# EAGLE design analog-io-breakout (EAGLE 8.3.2)
DESIGNER: JAKOB VOIGTS & JON NEWMAN; DESIGN_NAME: IO BOARD; LICENSE: CERN OHL v1.2; REVISION: 1.1
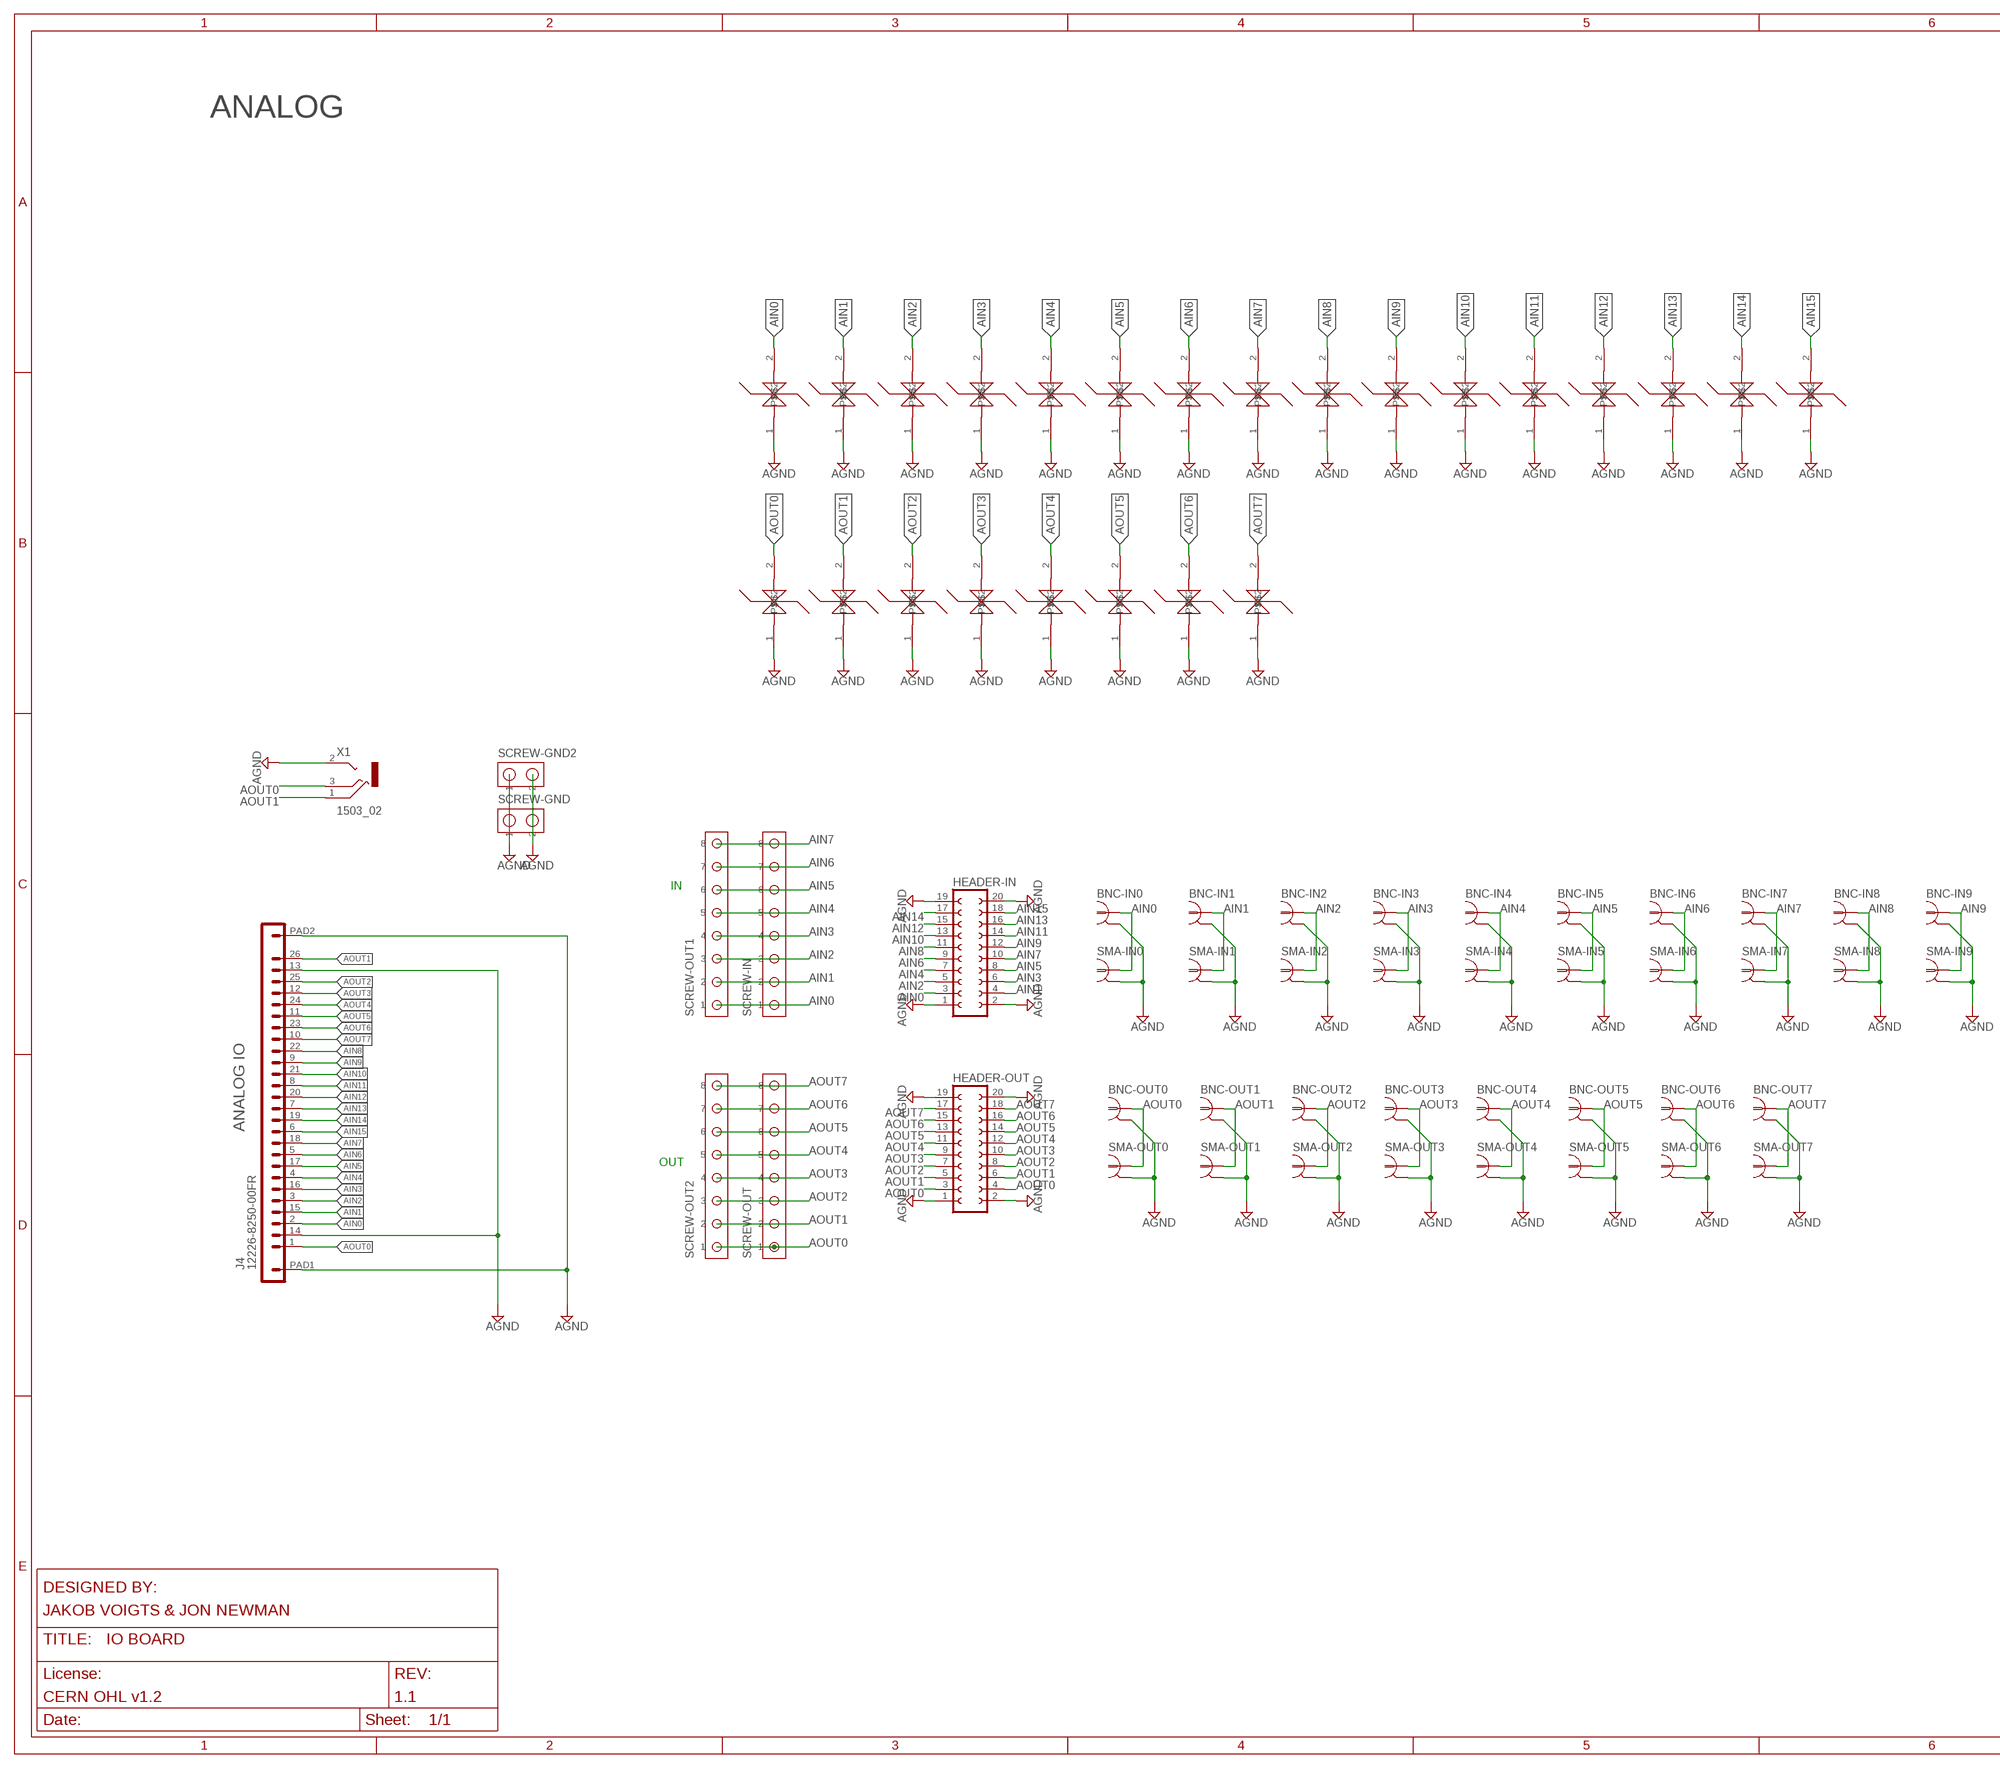
[diagram p0: schematic, sheet 1, part 1 of 2]
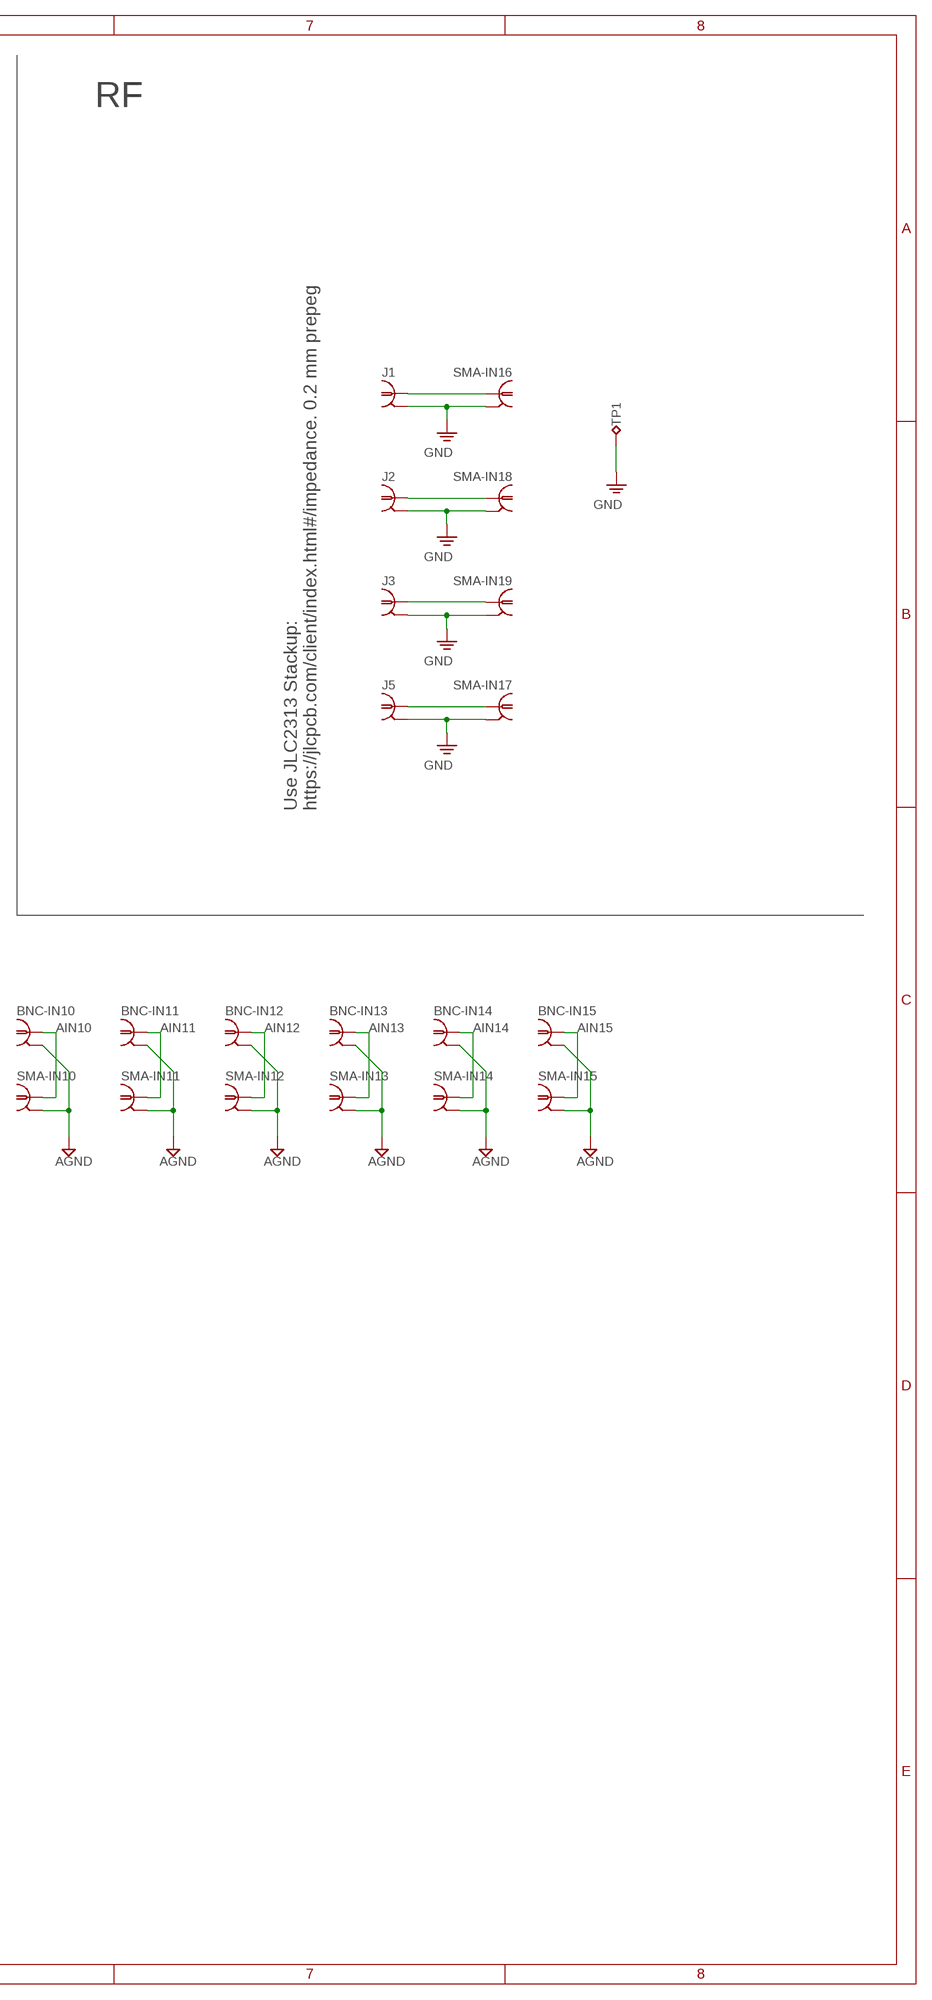
[diagram p1: schematic, sheet 1, part 2 of 2]

## Parts
BNC-IN0  COAX_B35N61-LARGE-HOLES  [B35N61_LARGE-HOLES]
BNC-IN1  COAX_B35N61-LARGE-HOLES  [B35N61_LARGE-HOLES]
BNC-IN2  COAX_B35N61-LARGE-HOLES  [B35N61_LARGE-HOLES]
BNC-IN3  COAX_B35N61-LARGE-HOLES  [B35N61_LARGE-HOLES]
BNC-IN4  COAX_B35N61-LARGE-HOLES  [B35N61_LARGE-HOLES]
BNC-IN5  COAX_B35N61-LARGE-HOLES  [B35N61_LARGE-HOLES]
BNC-IN6  COAX_B35N61-LARGE-HOLES  [B35N61_LARGE-HOLES]
BNC-IN7  COAX_B35N61-LARGE-HOLES  [B35N61_LARGE-HOLES]
BNC-IN8  COAX_B35N61-LARGE-HOLES  [B35N61_LARGE-HOLES]
BNC-IN9  COAX_B35N61-LARGE-HOLES  [B35N61_LARGE-HOLES]
BNC-IN10  COAX_B35N61-LARGE-HOLES  [B35N61_LARGE-HOLES]
BNC-IN11  COAX_B35N61-LARGE-HOLES  [B35N61_LARGE-HOLES]
BNC-IN12  COAX_B35N61-LARGE-HOLES  [B35N61_LARGE-HOLES]
BNC-IN13  COAX_B35N61-LARGE-HOLES  [B35N61_LARGE-HOLES]
BNC-IN14  COAX_B35N61-LARGE-HOLES  [B35N61_LARGE-HOLES]
BNC-IN15  COAX_B35N61-LARGE-HOLES  [B35N61_LARGE-HOLES]
BNC-OUT0  COAX_B35N61-LARGE-HOLES  [B35N61_LARGE-HOLES]
BNC-OUT1  COAX_B35N61-LARGE-HOLES  [B35N61_LARGE-HOLES]
BNC-OUT2  COAX_B35N61-LARGE-HOLES  [B35N61_LARGE-HOLES]
BNC-OUT3  COAX_B35N61-LARGE-HOLES  [B35N61_LARGE-HOLES]
BNC-OUT4  COAX_B35N61-LARGE-HOLES  [B35N61_LARGE-HOLES]
BNC-OUT5  COAX_B35N61-LARGE-HOLES  [B35N61_LARGE-HOLES]
BNC-OUT6  COAX_B35N61-LARGE-HOLES  [B35N61_LARGE-HOLES]
BNC-OUT7  COAX_B35N61-LARGE-HOLES  [B35N61_LARGE-HOLES]
HEADER-IN  FE10-2  [FE10-2]
HEADER-OUT  FE10-2  [FE10-2]
J1  COAX_MMCX-RA  [MMCX-J-P-X-RA-SM1]
J2  COAX_MMCX-RA  [MMCX-J-P-X-RA-SM1]
J3  COAX_MMCX-RA  [MMCX-J-P-X-RA-SM1]
J4  12226-8250-00FR  PINHD-1X26_122  [12226-82X0-00XX]
J5  COAX_MMCX-RA  [MMCX-J-P-X-RA-SM1]
SCREW-GND  SCREW2  [SCREW2]
SCREW-GND2  SCREW2  [SCREW2]
SCREW-IN  SCREW8  [SCREW8]
SCREW-OUT  SCREW8  [SCREW8]
SCREW-OUT1  SCREW8  [SCREW8]
SCREW-OUT2  SCREW8  [SCREW8]
SMA-IN0  COAX_SMA-VERT  [SMA_JACK_142-0701-201]
SMA-IN1  COAX_SMA-VERT  [SMA_JACK_142-0701-201]
SMA-IN2  COAX_SMA-VERT  [SMA_JACK_142-0701-201]
SMA-IN3  COAX_SMA-VERT  [SMA_JACK_142-0701-201]
SMA-IN4  COAX_SMA-VERT  [SMA_JACK_142-0701-201]
SMA-IN5  COAX_SMA-VERT  [SMA_JACK_142-0701-201]
SMA-IN6  COAX_SMA-VERT  [SMA_JACK_142-0701-201]
SMA-IN7  COAX_SMA-VERT  [SMA_JACK_142-0701-201]
SMA-IN8  COAX_SMA-VERT  [SMA_JACK_142-0701-201]
SMA-IN9  COAX_SMA-VERT  [SMA_JACK_142-0701-201]
SMA-IN10  COAX_SMA-VERT  [SMA_JACK_142-0701-201]
SMA-IN11  COAX_SMA-VERT  [SMA_JACK_142-0701-201]
SMA-IN12  COAX_SMA-VERT  [SMA_JACK_142-0701-201]
SMA-IN13  COAX_SMA-VERT  [SMA_JACK_142-0701-201]
SMA-IN14  COAX_SMA-VERT  [SMA_JACK_142-0701-201]
SMA-IN15  COAX_SMA-VERT  [SMA_JACK_142-0701-201]
SMA-IN16  COAX_SMA-VERT  [SMA_JACK_142-0701-201]
SMA-IN17  COAX_SMA-VERT  [SMA_JACK_142-0701-201]
SMA-IN18  COAX_SMA-VERT  [SMA_JACK_142-0701-201]
SMA-IN19  COAX_SMA-VERT  [SMA_JACK_142-0701-201]
SMA-OUT0  COAX_SMA-VERT  [SMA_JACK_142-0701-201]
SMA-OUT1  COAX_SMA-VERT  [SMA_JACK_142-0701-201]
SMA-OUT2  COAX_SMA-VERT  [SMA_JACK_142-0701-201]
SMA-OUT3  COAX_SMA-VERT  [SMA_JACK_142-0701-201]
SMA-OUT4  COAX_SMA-VERT  [SMA_JACK_142-0701-201]
SMA-OUT5  COAX_SMA-VERT  [SMA_JACK_142-0701-201]
SMA-OUT6  COAX_SMA-VERT  [SMA_JACK_142-0701-201]
SMA-OUT7  COAX_SMA-VERT  [SMA_JACK_142-0701-201]
TP1  TP_2MM  [TESTPOINT_2MM]
U$1  DIODE-ESD-BIDIRECTIONALDO-214AA  [DIOC7026X260]
U$2  DIODE-ESD-BIDIRECTIONALDO-214AA  [DIOC7026X260]
U$3  DIODE-ESD-BIDIRECTIONALDO-214AA  [DIOC7026X260]
U$4  DIODE-ESD-BIDIRECTIONALDO-214AA  [DIOC7026X260]
U$5  DIODE-ESD-BIDIRECTIONALDO-214AA  [DIOC7026X260]
U$6  DIODE-ESD-BIDIRECTIONALDO-214AA  [DIOC7026X260]
U$7  DIODE-ESD-BIDIRECTIONALDO-214AA  [DIOC7026X260]
U$8  DIODE-ESD-BIDIRECTIONALDO-214AA  [DIOC7026X260]
U$9  DIODE-ESD-BIDIRECTIONALDO-214AA  [DIOC7026X260]
U$10  DIODE-ESD-BIDIRECTIONALDO-214AA  [DIOC7026X260]
U$11  DIODE-ESD-BIDIRECTIONALDO-214AA  [DIOC7026X260]
U$12  DIODE-ESD-BIDIRECTIONALDO-214AA  [DIOC7026X260]
U$13  DIODE-ESD-BIDIRECTIONALDO-214AA  [DIOC7026X260]
U$14  DIODE-ESD-BIDIRECTIONALDO-214AA  [DIOC7026X260]
U$15  DIODE-ESD-BIDIRECTIONALDO-214AA  [DIOC7026X260]
U$16  DIODE-ESD-BIDIRECTIONALDO-214AA  [DIOC7026X260]
U$17  DIODE-ESD-BIDIRECTIONALDO-214AA  [DIOC7026X260]
U$18  DIODE-ESD-BIDIRECTIONALDO-214AA  [DIOC7026X260]
U$19  DIODE-ESD-BIDIRECTIONALDO-214AA  [DIOC7026X260]
U$20  DIODE-ESD-BIDIRECTIONALDO-214AA  [DIOC7026X260]
U$21  DIODE-ESD-BIDIRECTIONALDO-214AA  [DIOC7026X260]
U$22  DIODE-ESD-BIDIRECTIONALDO-214AA  [DIOC7026X260]
U$23  DIODE-ESD-BIDIRECTIONALDO-214AA  [DIOC7026X260]
U$24  DIODE-ESD-BIDIRECTIONALDO-214AA  [DIOC7026X260]
X1  1503_02  [1503_02]

## Nets
AGND: BNC-IN0.2 BNC-IN0.3 BNC-IN0.4 BNC-IN0.5 BNC-IN1.2 BNC-IN1.3 BNC-IN1.4 BNC-IN1.5 BNC-IN2.2 BNC-IN2.3 BNC-IN2.4 BNC-IN2.5 BNC-IN3.2 BNC-IN3.3 BNC-IN3.4 BNC-IN3.5 BNC-IN4.2 BNC-IN4.3 BNC-IN4.4 BNC-IN4.5 BNC-IN5.2 BNC-IN5.3 BNC-IN5.4 BNC-IN5.5 BNC-IN6.2 BNC-IN6.3 BNC-IN6.4 BNC-IN6.5 BNC-IN7.2 BNC-IN7.3 BNC-IN7.4 BNC-IN7.5 BNC-IN8.2 BNC-IN8.3 BNC-IN8.4 BNC-IN8.5 BNC-IN9.2 BNC-IN9.3 BNC-IN9.4 BNC-IN9.5 BNC-IN10.2 BNC-IN10.3 BNC-IN10.4 BNC-IN10.5 BNC-IN11.2 BNC-IN11.3 BNC-IN11.4 BNC-IN11.5 BNC-IN12.2 BNC-IN12.3 BNC-IN12.4 BNC-IN12.5 BNC-IN13.2 BNC-IN13.3 BNC-IN13.4 BNC-IN13.5 BNC-IN14.2 BNC-IN14.3 BNC-IN14.4 BNC-IN14.5 BNC-IN15.2 BNC-IN15.3 BNC-IN15.4 BNC-IN15.5 BNC-OUT0.2 BNC-OUT0.3 BNC-OUT0.4 BNC-OUT0.5 BNC-OUT1.2 BNC-OUT1.3 BNC-OUT1.4 BNC-OUT1.5 BNC-OUT2.2 BNC-OUT2.3 BNC-OUT2.4 BNC-OUT2.5 BNC-OUT3.2 BNC-OUT3.3 BNC-OUT3.4 BNC-OUT3.5 BNC-OUT4.2 BNC-OUT4.3 BNC-OUT4.4 BNC-OUT4.5 BNC-OUT5.2 BNC-OUT5.3 BNC-OUT5.4 BNC-OUT5.5 BNC-OUT6.2 BNC-OUT6.3 BNC-OUT6.4 BNC-OUT6.5 BNC-OUT7.2 BNC-OUT7.3 BNC-OUT7.4 BNC-OUT7.5 HEADER-IN.1 HEADER-IN.2 HEADER-IN.19 HEADER-IN.20 HEADER-OUT.1 HEADER-OUT.2 HEADER-OUT.19 HEADER-OUT.20 J4.13 J4.14 J4.PAD1 J4.PAD2 SCREW-GND2.P$1 SCREW-GND2.P$2 SCREW-GND.P$1 SCREW-GND.P$2 SMA-IN0.GND$1 SMA-IN0.GND$2 SMA-IN0.GND$3 SMA-IN0.GND$4 SMA-IN1.GND$1 SMA-IN1.GND$2 SMA-IN1.GND$3 SMA-IN1.GND$4 SMA-IN2.GND$1 SMA-IN2.GND$2 SMA-IN2.GND$3 SMA-IN2.GND$4 SMA-IN3.GND$1 SMA-IN3.GND$2 SMA-IN3.GND$3 SMA-IN3.GND$4 SMA-IN4.GND$1 SMA-IN4.GND$2 SMA-IN4.GND$3 SMA-IN4.GND$4 SMA-IN5.GND$1 SMA-IN5.GND$2 SMA-IN5.GND$3 SMA-IN5.GND$4 SMA-IN6.GND$1 SMA-IN6.GND$2 SMA-IN6.GND$3 SMA-IN6.GND$4 SMA-IN7.GND$1 SMA-IN7.GND$2 SMA-IN7.GND$3 SMA-IN7.GND$4 SMA-IN8.GND$1 SMA-IN8.GND$2 SMA-IN8.GND$3 SMA-IN8.GND$4 SMA-IN9.GND$1 SMA-IN9.GND$2 SMA-IN9.GND$3 SMA-IN9.GND$4 SMA-IN10.GND$1 SMA-IN10.GND$2 SMA-IN10.GND$3 SMA-IN10.GND$4 SMA-IN11.GND$1 SMA-IN11.GND$2 SMA-IN11.GND$3 SMA-IN11.GND$4 SMA-IN12.GND$1 SMA-IN12.GND$2 SMA-IN12.GND$3 SMA-IN12.GND$4 SMA-IN13.GND$1 SMA-IN13.GND$2 SMA-IN13.GND$3 SMA-IN13.GND$4 SMA-IN14.GND$1 SMA-IN14.GND$2 SMA-IN14.GND$3 SMA-IN14.GND$4 SMA-IN15.GND$1 SMA-IN15.GND$2 SMA-IN15.GND$3 SMA-IN15.GND$4 SMA-OUT0.GND$1 SMA-OUT0.GND$2 SMA-OUT0.GND$3 SMA-OUT0.GND$4 SMA-OUT1.GND$1 SMA-OUT1.GND$2 SMA-OUT1.GND$3 SMA-OUT1.GND$4 SMA-OUT2.GND$1 SMA-OUT2.GND$2 SMA-OUT2.GND$3 SMA-OUT2.GND$4 SMA-OUT3.GND$1 SMA-OUT3.GND$2 SMA-OUT3.GND$3 SMA-OUT3.GND$4 SMA-OUT4.GND$1 SMA-OUT4.GND$2 SMA-OUT4.GND$3 SMA-OUT4.GND$4 SMA-OUT5.GND$1 SMA-OUT5.GND$2 SMA-OUT5.GND$3 SMA-OUT5.GND$4 SMA-OUT6.GND$1 SMA-OUT6.GND$2 SMA-OUT6.GND$3 SMA-OUT6.GND$4 SMA-OUT7.GND$1 SMA-OUT7.GND$2 SMA-OUT7.GND$3 SMA-OUT7.GND$4 U$1.1 U$2.1 U$3.1 U$4.1 U$5.1 U$6.1 U$7.1 U$8.1 U$9.1 U$10.1 U$11.1 U$12.1 U$13.1 U$14.1 U$15.1 U$16.1 U$17.1 U$18.1 U$19.1 U$20.1 U$21.1 U$22.1 U$23.1 U$24.1 X1.2
AIN0: BNC-IN0.1 HEADER-IN.3 J4.2 SCREW-IN.1 SCREW-OUT1.1 SMA-IN0.CLK U$1.2
AIN1: BNC-IN1.1 HEADER-IN.4 J4.15 SCREW-IN.2 SCREW-OUT1.2 SMA-IN1.CLK U$2.2
AIN2: BNC-IN2.1 HEADER-IN.5 J4.3 SCREW-IN.3 SCREW-OUT1.3 SMA-IN2.CLK U$3.2
AIN3: BNC-IN3.1 HEADER-IN.6 J4.16 SCREW-IN.4 SCREW-OUT1.4 SMA-IN3.CLK U$4.2
AIN4: BNC-IN4.1 HEADER-IN.7 J4.4 SCREW-IN.5 SCREW-OUT1.5 SMA-IN4.CLK U$5.2
AIN5: BNC-IN5.1 HEADER-IN.8 J4.17 SCREW-IN.6 SCREW-OUT1.6 SMA-IN5.CLK U$6.2
AIN6: BNC-IN6.1 HEADER-IN.9 J4.5 SCREW-IN.7 SCREW-OUT1.7 SMA-IN6.CLK U$7.2
AIN7: BNC-IN7.1 HEADER-IN.10 J4.18 SCREW-IN.8 SCREW-OUT1.8 SMA-IN7.CLK U$8.2
AIN8: BNC-IN8.1 HEADER-IN.11 J4.22 SMA-IN8.CLK U$17.2
AIN9: BNC-IN9.1 HEADER-IN.12 J4.9 SMA-IN9.CLK U$18.2
AIN10: BNC-IN10.1 HEADER-IN.13 J4.21 SMA-IN10.CLK U$19.2
AIN11: BNC-IN11.1 HEADER-IN.14 J4.8 SMA-IN11.CLK U$20.2
AIN12: BNC-IN12.1 HEADER-IN.15 J4.20 SMA-IN12.CLK U$21.2
AIN13: BNC-IN13.1 HEADER-IN.16 J4.7 SMA-IN13.CLK U$22.2
AIN14: BNC-IN14.1 HEADER-IN.17 J4.19 SMA-IN14.CLK U$23.2
AIN15: BNC-IN15.1 HEADER-IN.18 J4.6 SMA-IN15.CLK U$24.2
AOUT0: BNC-OUT0.1 HEADER-OUT.3 HEADER-OUT.4 J4.1 SCREW-OUT2.1 SCREW-OUT.1 SMA-OUT0.CLK U$9.2 X1.3
AOUT1: BNC-OUT1.1 HEADER-OUT.5 HEADER-OUT.6 J4.26 SCREW-OUT2.2 SCREW-OUT.2 SMA-OUT1.CLK U$10.2 X1.1
AOUT2: BNC-OUT2.1 HEADER-OUT.7 HEADER-OUT.8 J4.25 SCREW-OUT2.3 SCREW-OUT.3 SMA-OUT2.CLK U$11.2
AOUT3: BNC-OUT3.1 HEADER-OUT.9 HEADER-OUT.10 J4.12 SCREW-OUT2.4 SCREW-OUT.4 SMA-OUT3.CLK U$12.2
AOUT4: BNC-OUT4.1 HEADER-OUT.11 HEADER-OUT.12 J4.24 SCREW-OUT2.5 SCREW-OUT.5 SMA-OUT4.CLK U$13.2
AOUT5: BNC-OUT5.1 HEADER-OUT.13 HEADER-OUT.14 J4.11 SCREW-OUT2.6 SCREW-OUT.6 SMA-OUT5.CLK U$14.2
AOUT6: BNC-OUT6.1 HEADER-OUT.15 HEADER-OUT.16 J4.23 SCREW-OUT2.7 SCREW-OUT.7 SMA-OUT6.CLK U$15.2
AOUT7: BNC-OUT7.1 HEADER-OUT.17 HEADER-OUT.18 J4.10 SCREW-OUT2.8 SCREW-OUT.8 SMA-OUT7.CLK U$16.2
GND: J1.2 J1.3 J1.4 J1.5 J2.2 J2.3 J2.4 J2.5 J3.2 J3.3 J3.4 J3.5 J5.2 J5.3 J5.4 J5.5 SMA-IN16.GND$1 SMA-IN16.GND$2 SMA-IN16.GND$3 SMA-IN16.GND$4 SMA-IN17.GND$1 SMA-IN17.GND$2 SMA-IN17.GND$3 SMA-IN17.GND$4 SMA-IN18.GND$1 SMA-IN18.GND$2 SMA-IN18.GND$3 SMA-IN18.GND$4 SMA-IN19.GND$1 SMA-IN19.GND$2 SMA-IN19.GND$3 SMA-IN19.GND$4 TP1.1(TP)
N$1: J1.1 SMA-IN16.CLK
N$3: J2.1 SMA-IN18.CLK
N$4: J3.1 SMA-IN19.CLK
N$5: J5.1 SMA-IN17.CLK
Unconnected: X1.2@2

## Notes on the sheet
- RF
- ANALOG
- Use JLC2313 Stackup: 
  https://jlcpcb.com/client/index.html#/impedance. 0.2 mm prepeg
- IN
- ANALOG IO
- OUT

## Library data of the parts
BNC-IN0 BNC-IN1-BNC-IN15 BNC-OUT0 BNC-OUT1-BNC-OUT7 J1-J3 J5 SMA-IN0 SMA-IN1-SMA-IN19 SMA-OUT0 SMA-OUT1-SMA-OUT7 = jonnew:COAX: COAX CONNECTOR - Edge mount BNC - Vertical BNC - Vertical SMA - etc
HEADER-IN HEADER-OUT = con-lsta:FE10-2: FEMALE HEADER; OC_FARNELL: unknown; OC_NEWARK: unknown
J4 = jonnew:PINHD-1X26
SCREW-GND SCREW-GND2 = jonnew:SCREW2: Screw Terminal
SCREW-IN SCREW-OUT SCREW-OUT1 SCREW-OUT2 = jonnew:SCREW8: Screw Terminal
TP1 = jonnew:TP: Test pad
U$1-U$24 = jonnew:DIODE-ESD-BIDIRECTIONAL
X1 = con-lumberg:1503_02: Jack connectors according to JISC 6560, 3.5 mm Klinkeneinbaukupplung nach JISC 6560, 3,5 mm, 3-polig/stereo, abgewinkelte Ausführung, Surface-Mount-Technik (SMT) Source: http://www.lumberg.com/Produkte/PDFs/1503_02.pdf; OC_FARNELL: 1216979; OC_NEWARK: unknown

## Net classes
1 diff: width 0.229 mm, drill 0.33 mm, clearance 0.127 mm

## Board
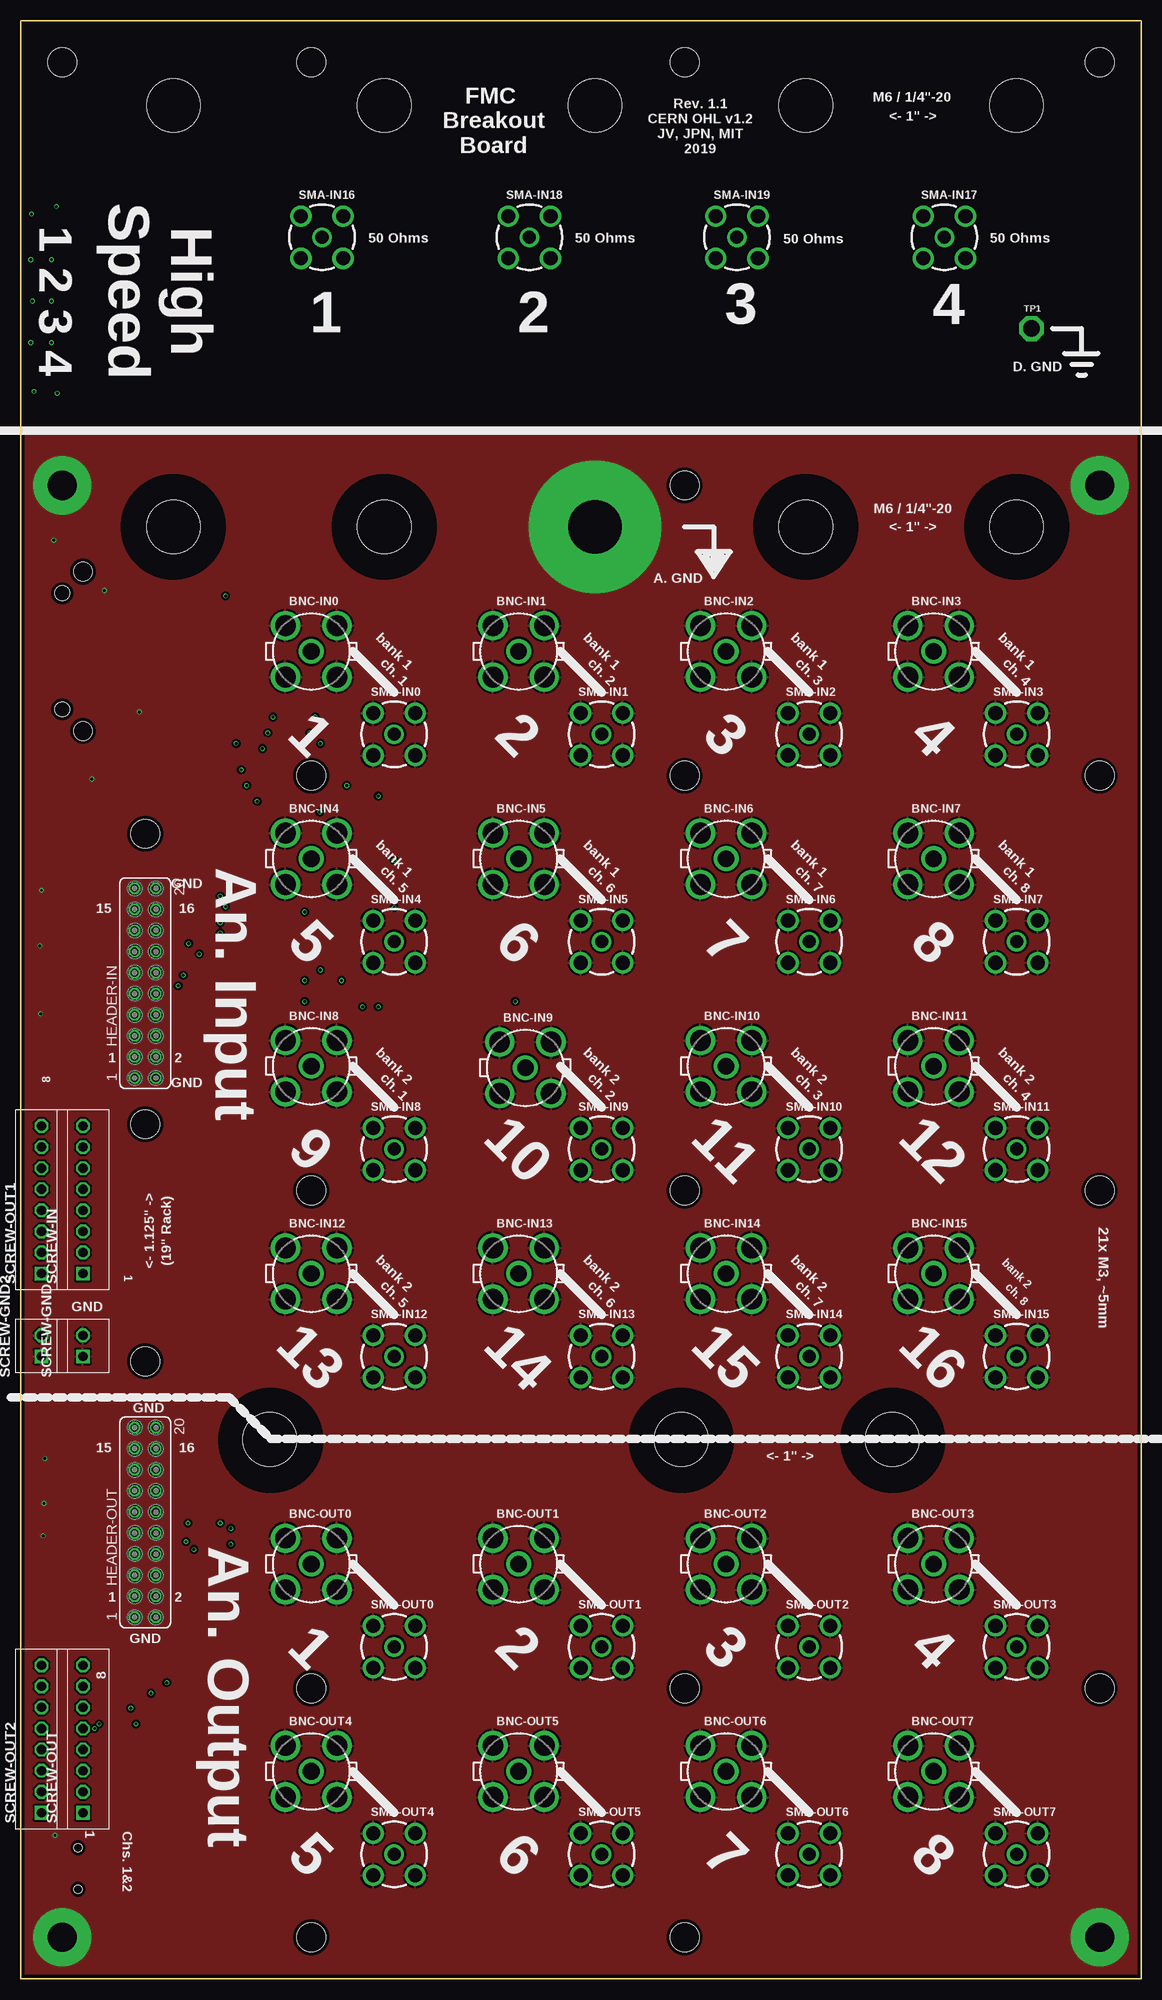
[diagram p2: board, top side]
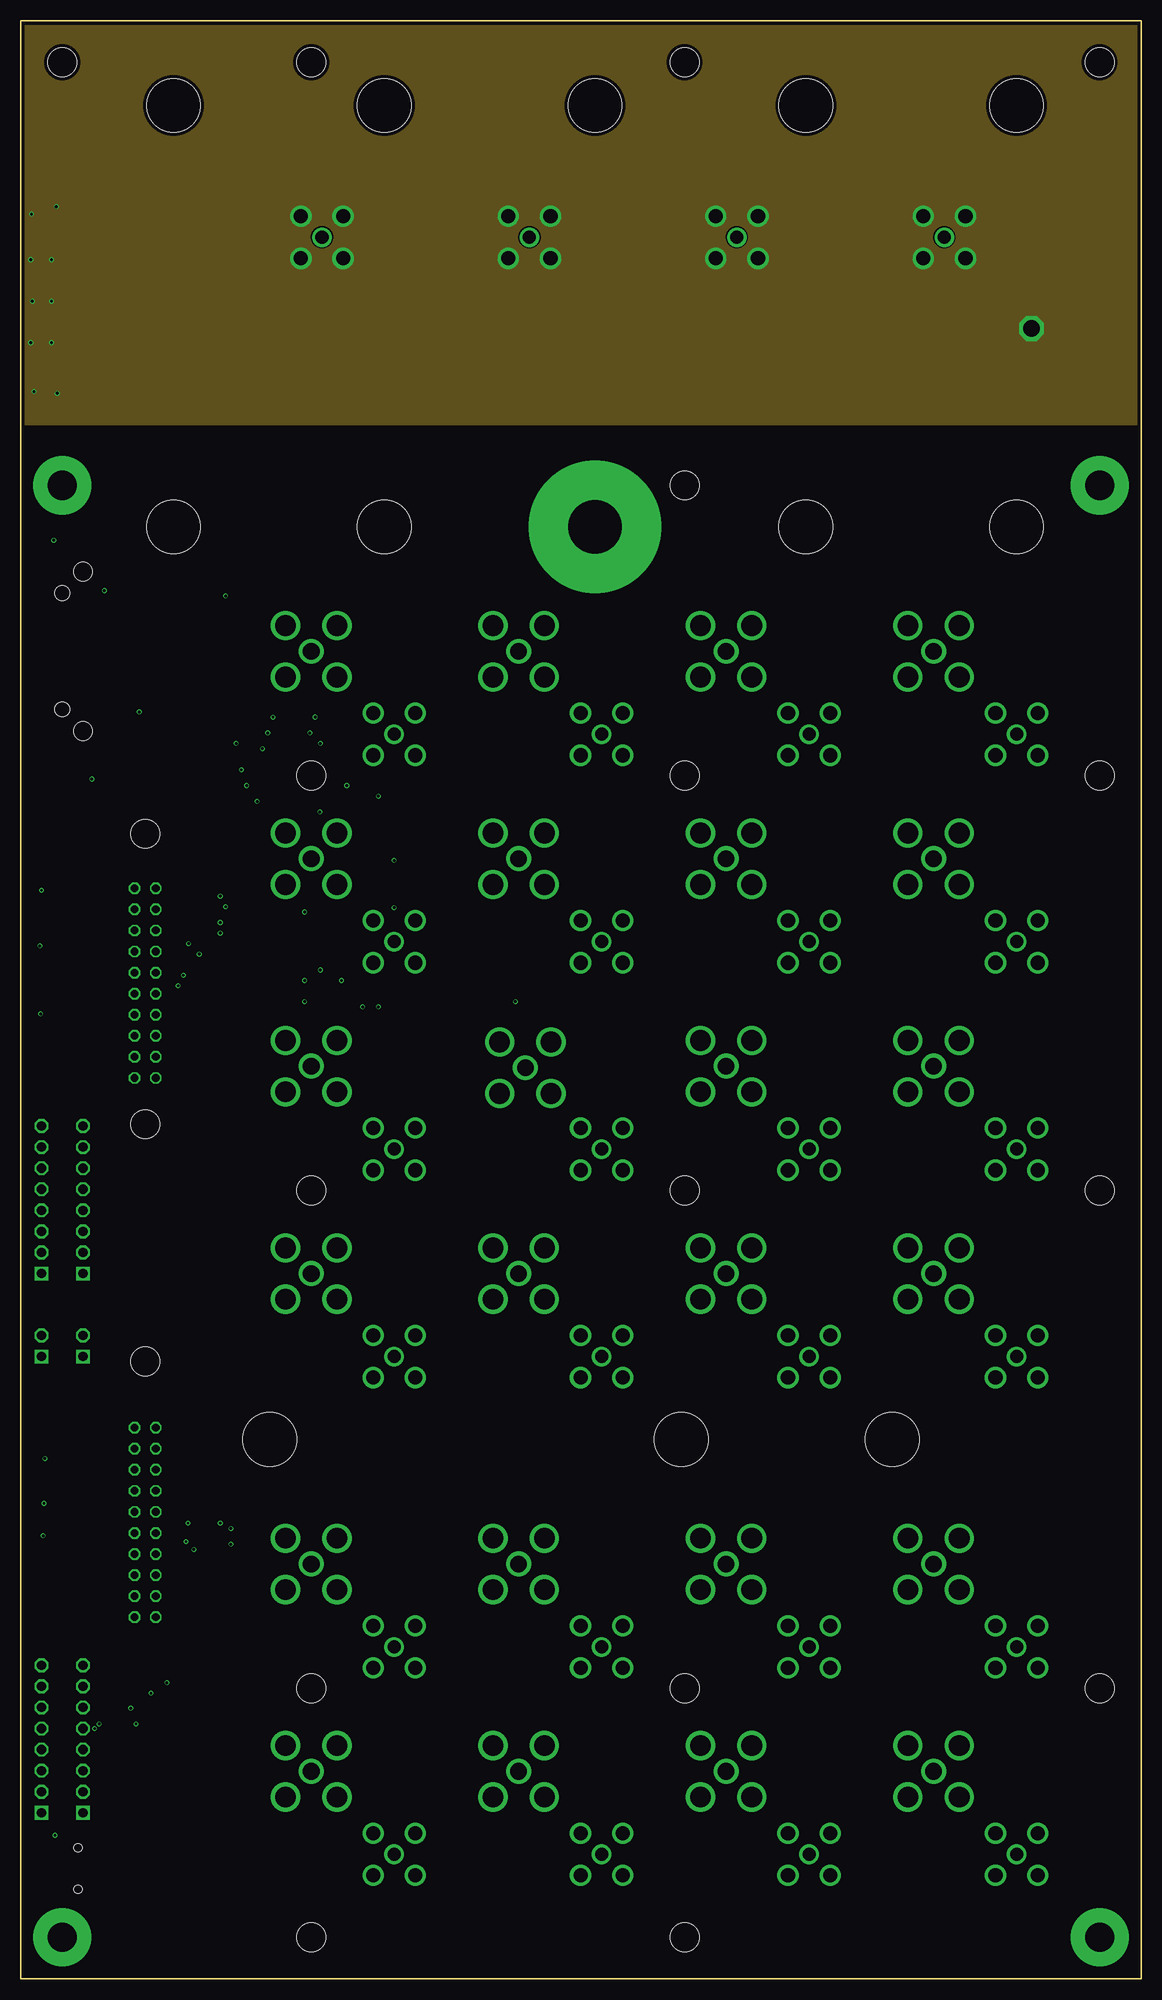
[diagram p3: board, inner layer Route2]
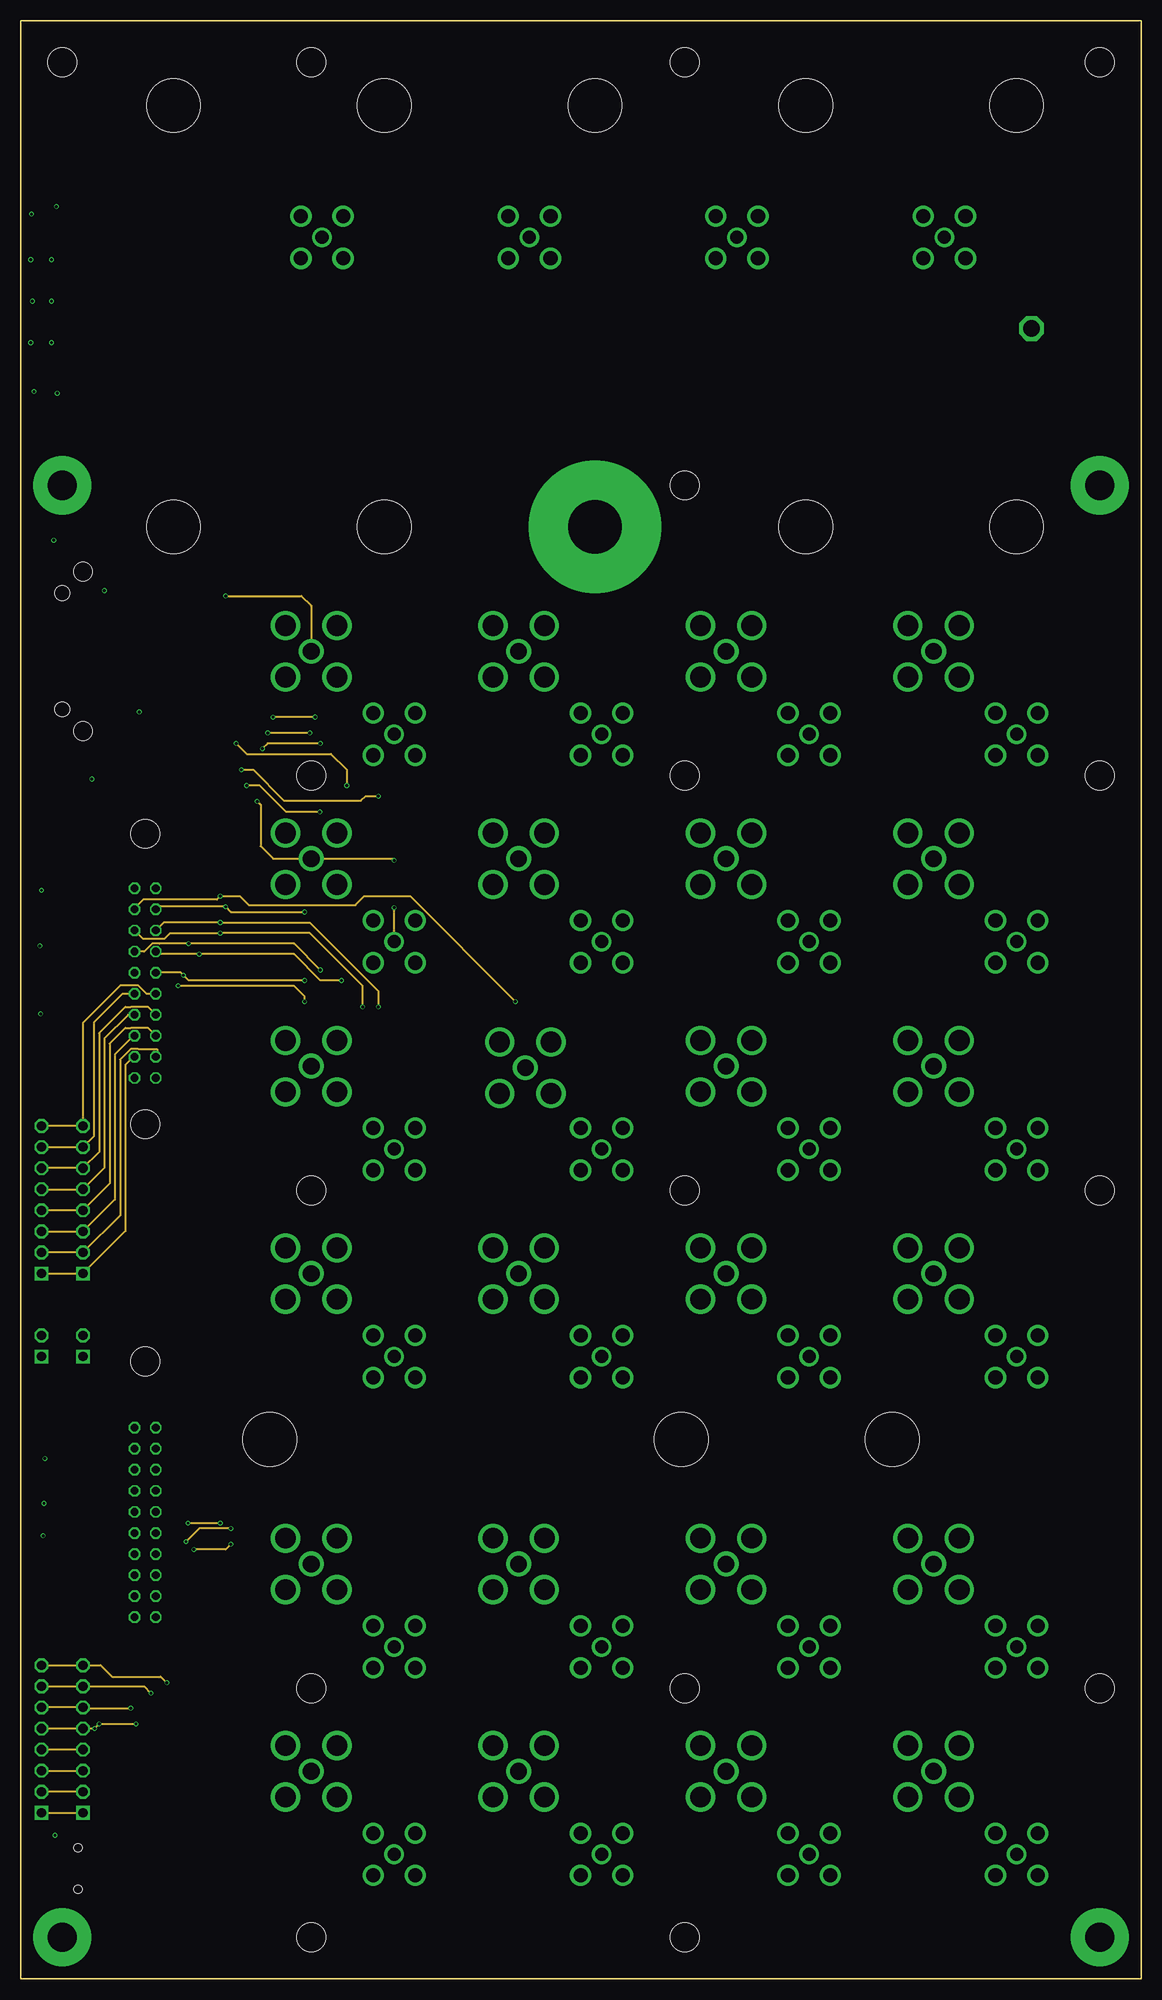
[diagram p4: board, inner layer Route15]
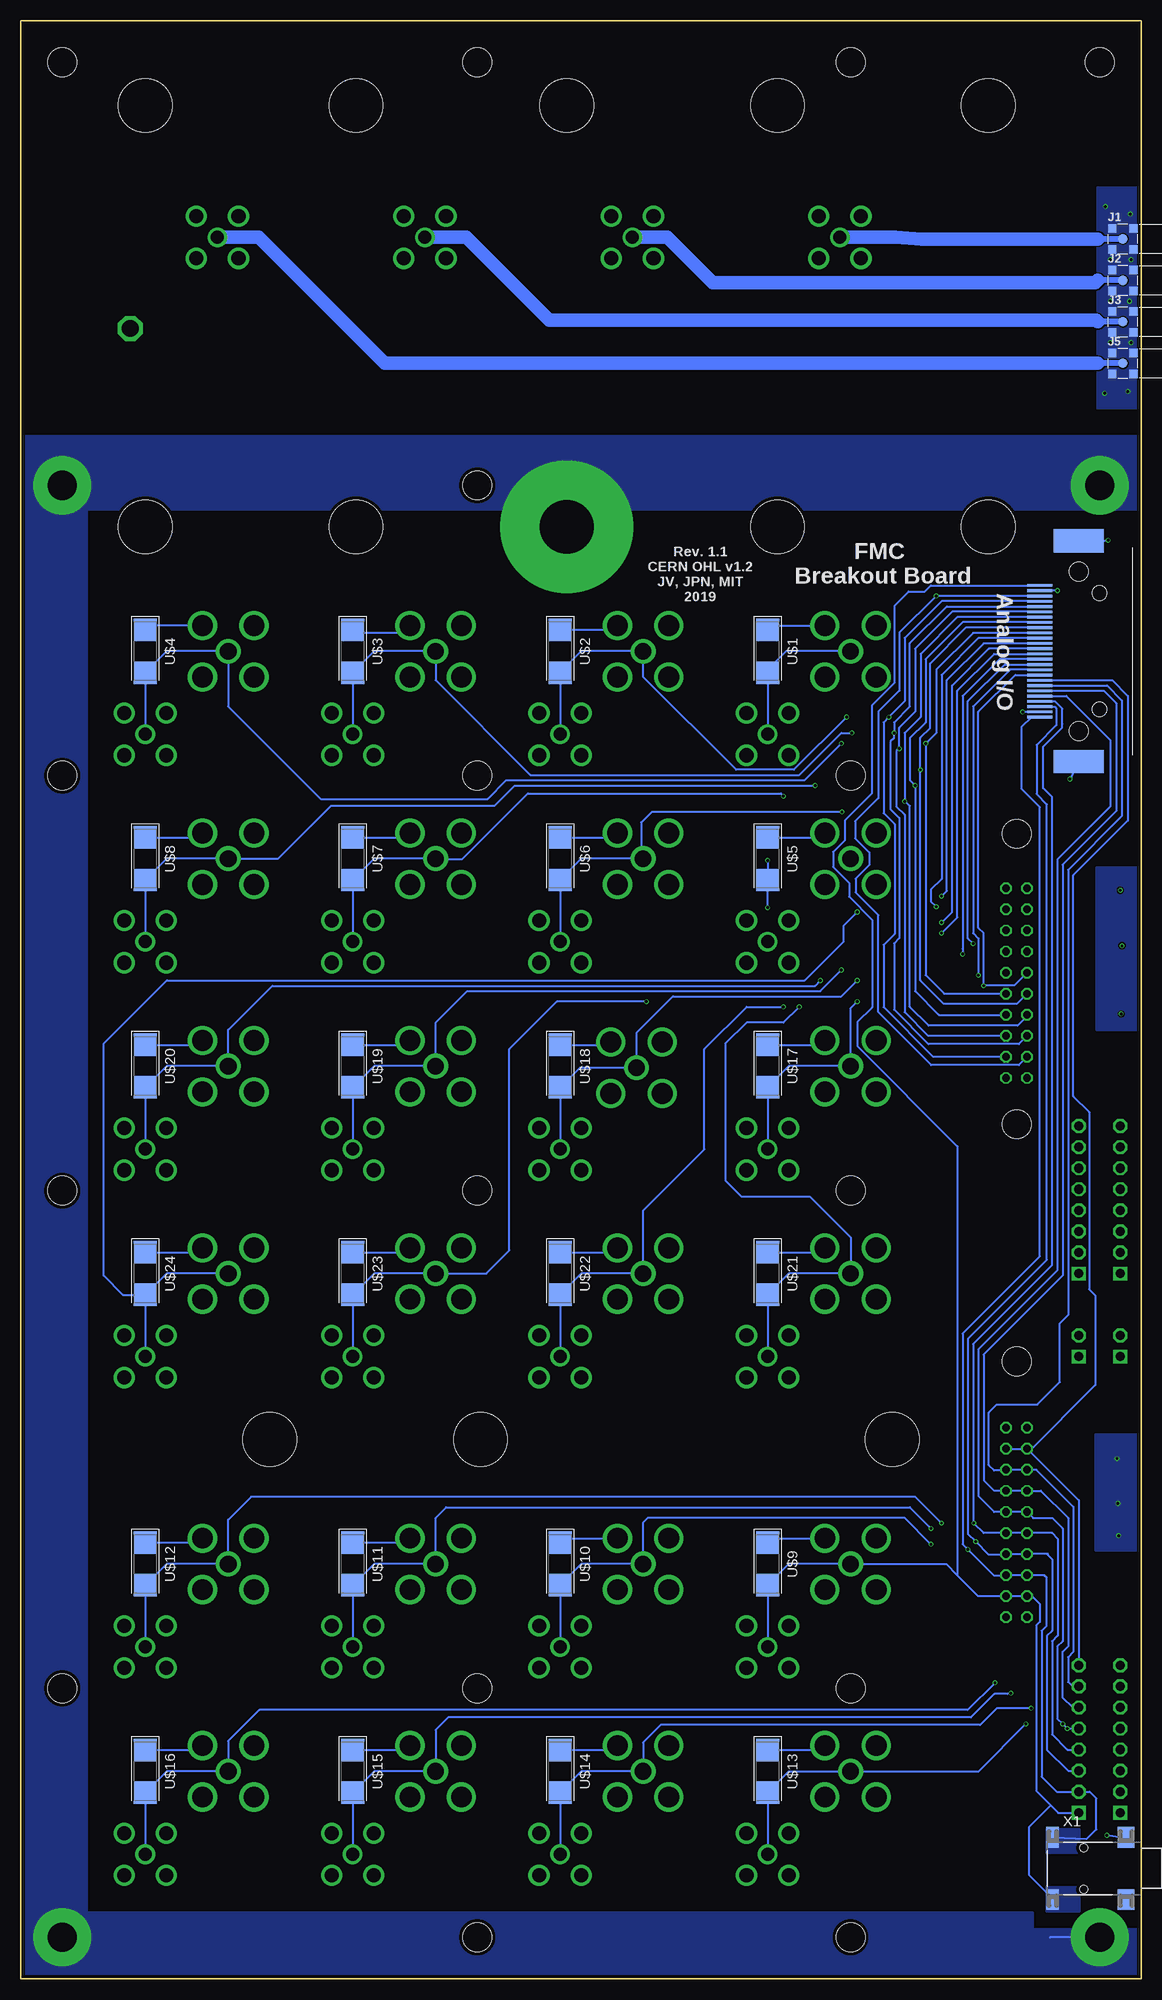
[diagram p5: board, bottom side, seen from below]

Size 135 x 236 mm. Coordinates in mm from the lower left corner, seen from the top.
Outline: 0,236 135,236 135,0 0,0 0,236
Copper layers (1*2*15*16): Top 0.035mm / dielectric 0.2mm / Route2 0.0175mm / dielectric 0.3mm / Route15 0.0175mm / dielectric 0.2mm / Bottom 0.035mm
Design rules "seeed-studio-4-layer": minimum track width 6mil, minimum drill 0.3mm, track to track 6mil, track to pad 6mil, pad to pad 6mil, via to via 6mil, smd to smd 0mil, copper to edge 0.4mm, drill to drill 10mil, minimum pad ring 6mil, minimum via ring 4mil, stop-mask expansion 4mil, vias tented up to drill 100mil, thermal gap 10mil
Holes 3.5 mm at 80,5 80,180 35,145 35,95 80,95 80,145 35,35 80,35 35,5 130,95 130,35 130,145 15,103 5,231 15,138 15,74.43 80,231 130,231 35,231
Holes 6.5 mm at 120,175 105,65 30,65 94.6,175 79.6,65 18.4,175 43.8,175 18.4,225.8 43.8,225.8 94.6,225.8 120,225.8 69.2,225.8
tRestrict: area 88.6,169 to 100.6,181; area 114,169 to 126,181; area 99.1,58.9 to 111.1,70.9; area 73.6,58.9 to 85.6,70.9; area 12.4,169 to 24.4,181; area 24.1,58.9 to 36.1,70.9; area 37.8,169 to 49.8,181; area 12.4,219.8 to 24.4,231.8; area 37.8,219.8 to 49.8,231.8; area 88.6,219.8 to 100.6,231.8; area 114,219.8 to 126,231.8; area 63.2,219.8 to 75.2,231.8

### Footprints (pad centres in the part's own frame; a part is rotated, then mirrored left to right if it is on the bottom)
B35N61_LARGE-HOLES = drill 2: 1 0,0 | drill 2.5: 2 3.099,3.099; 3 -3.099,3.099; 4 -3.099,-3.099; 5 3.099,-3.099
FE10-2 = drill 0.914 octagon: 1 -11.43,1.27; 2 -11.43,-1.27; 3 -8.89,1.27; 4 -8.89,-1.27; 5 -6.35,1.27; 6 -6.35,-1.27; 7 -3.81,1.27; 8 -3.81,-1.27; 9 -1.27,1.27; 10 -1.27,-1.27; 11 1.27,1.27; 12 1.27,-1.27; 13 3.81,1.27; 14 3.81,-1.27; 15 6.35,1.27; 16 6.35,-1.27; 17 8.89,1.27; 18 8.89,-1.27; 19 11.43,1.27; 20 11.43,-1.27
MMCX-J-P-X-RA-SM1 = smd 1.15 x 1.15: 1 0,0 | smd 1 x 1: 2 1.27,1.27; 3 -1.27,1.27; 4 -1.27,-1.27; 5 1.27,-1.27
12226-82X0-00XX = smd 0.335 x 3: 1 7.938,7.2; 2 6.668,7.2; 3 5.397,7.2; 4 4.128,7.2; 5 2.857,7.2; 6 1.587,7.2; 7 0.318,7.2; 8 -0.953,7.2; 9 -2.223,7.2; 10 -3.493,7.2; 11 -4.763,7.2; 12 -6.032,7.2; 13 -7.303,7.2; 14 7.303,7.2; 15 6.032,7.2; 16 4.763,7.2; 17 3.493,7.2; 18 2.223,7.2; 19 0.953,7.2; 20 -0.318,7.2; 21 -1.587,7.2; 22 -2.857,7.2; 23 -4.128,7.2; 24 -5.397,7.2; 25 -6.668,7.2; 26 -7.938,7.2 | smd 2.8 x 6: PAD1 -13.3,2.5; PAD2 13.3,2.5 | hole 1.8: 7,0; -7,0 | hole 2.3: 9.6,2.5; -9.6,2.5
SCREW2 = drill 1.1 square: P$1 0,0 | drill 1.1 octagon: P$2 2.54,0
SCREW8 = drill 1.1 square: 1 0,0 | drill 1.1 octagon: 2 2.54,0; 3 5.08,0; 4 7.62,0; 5 10.16,0; 6 12.7,0; 7 15.24,0; 8 17.78,0
SMA_JACK_142-0701-201 = drill 1.575: CLK 0,0 | drill 1.702: GND$1 -2.54,2.54; GND$2 2.54,2.54; GND$3 -2.54,-2.54; GND$4 2.54,-2.54
TESTPOINT_2MM = drill 2 octagon: 1 0,0
DIOC7026X260 = smd 2.71 x 2.75: 1 -2.57,0; 2 2.57,0
1503_02 = smd 2.5 x 1.5: 1 -3.75,-10.75; 3 3.75,-10.75 | smd 2.5 x 2: 2 -3.75,-1.9; 2@2 3.75,-1.9 | hole 1: -2.5,-7; 2.5,-7

### Placement (x,y rotation side)
BNC-IN0  35,160 0 top
BNC-IN1  60,160 0 top
BNC-IN2  85,160 0 top
BNC-IN3  110,160 0 top
BNC-IN4  35,135 0 top
BNC-IN5  60,135 0 top
BNC-IN6  85,135 0 top
BNC-IN7  110,135 0 top
BNC-IN8  35,110 0 top
BNC-IN9  60.8,109.8 0 top
BNC-IN10  85,110 0 top
BNC-IN11  110,110 0 top
BNC-IN12  35,85 0 top
BNC-IN13  60,85 0 top
BNC-IN14  85,85 0 top
BNC-IN15  110,85 0 top
BNC-OUT0  35,50 0 top
BNC-OUT1  60,50 0 top
BNC-OUT2  85,50 0 top
BNC-OUT3  110,50 0 top
BNC-OUT4  35,25 0 top
BNC-OUT5  60,25 0 top
BNC-OUT6  85,25 0 top
BNC-OUT7  110,25 0 top
HEADER-IN  15,120 90 top
HEADER-OUT  15,55 90 top
J1  2.2,209.7 270 bottom
J2  2.2,204.7 270 bottom
J3  2.2,199.7 270 bottom
J4  5,160 90 bottom
J5  2.2,194.7 270 bottom
SCREW-GND  7.5,75 90 top
SCREW-GND2  2.5,75 90 top
SCREW-IN  7.5,85 90 top
SCREW-OUT  7.5,20 90 top
SCREW-OUT1  2.5,85 90 top
SCREW-OUT2  2.5,20 90 top
SMA-IN0  45,150 0 top
SMA-IN1  70,150 0 top
SMA-IN2  95,150 0 top
SMA-IN3  120,150 0 top
SMA-IN4  45,125 0 top
SMA-IN5  70,125 0 top
SMA-IN6  95,125 0 top
SMA-IN7  120,125 0 top
SMA-IN8  45,100 0 top
SMA-IN9  70,100 0 top
SMA-IN10  95,100 0 top
SMA-IN11  120,100 0 top
SMA-IN12  45,75 0 top
SMA-IN13  70,75 0 top
SMA-IN14  95,75 0 top
SMA-IN15  120,75 0 top
SMA-IN16  36.3,209.9 0 top
SMA-IN17  111.3,209.9 0 top
SMA-IN18  61.3,209.9 0 top
SMA-IN19  86.3,209.9 0 top
SMA-OUT0  45,40 0 top
SMA-OUT1  70,40 0 top
SMA-OUT2  95,40 0 top
SMA-OUT3  120,40 0 top
SMA-OUT4  45,15 0 top
SMA-OUT5  70,15 0 top
SMA-OUT6  95,15 0 top
SMA-OUT7  120,15 0 top
TP1  121.8,198.9 0 top
U$1  45,160 270 bottom
U$2  70,160 270 bottom
U$3  95,160 270 bottom
U$4  120,160 270 bottom
U$5  45,135 270 bottom
U$6  70,135 270 bottom
U$7  95,135 270 bottom
U$8  120,135 270 bottom
U$9  45,50 270 bottom
U$10  70,50 270 bottom
U$11  95,50 270 bottom
U$12  120,50 270 bottom
U$13  45,25 270 bottom
U$14  70,25 270 bottom
U$15  95,25 270 bottom
U$16  120,25 270 bottom
U$17  45,110 270 bottom
U$18  70,110 270 bottom
U$19  95,110 270 bottom
U$20  120,110 270 bottom
U$21  45,85 270 bottom
U$22  70,85 270 bottom
U$23  95,85 270 bottom
U$24  120,85 270 bottom
X1  -0.1,13.3 270 bottom

### Tracks (layer width: path | path; a pad name or v marks a point on that pad's centre or on a via)
AGND  (via drill 0.35, 3.5 pad 7, 6.5 pad 16)
  Bottom 0.254: J4.13 v14.28,152.69 | 44.77,163.1 BNC-IN0.2 | 44.37,162.87 44.37,163.5 44.77,163.1 | U$2.1 63.63,162.57 BNC-IN1.2 | BNC-IN2.2 88.97,162.23 95.8,162.23 95.8,162.57 U$3.1 | BNC-IN3.2 119.47,163.1 U$4.1 120.3,162.87 120.56,162.87 | U$8.1 113.63,137.57 BNC-IN7.2 | U$20.1 113.63,112.57 BNC-IN11.2 | U$19.1 88.63,112.57 BNC-IN10.2 | U$7.1 88.63,137.57 BNC-IN6.2 | U$6.1 63.63,137.57 BNC-IN5.2 | U$5.1 38.63,137.57 BNC-IN4.2 | U$17.1 38.63,112.57 BNC-IN8.2 | U$18.1 64.23,112.57 BNC-IN9.2 | U$21.1 38.63,87.57 BNC-IN12.2 | U$22.1 63.63,87.57 BNC-IN13.2 | U$23.1 88.63,87.57 BNC-IN14.2 | U$24.1 113.63,87.57 BNC-IN15.2 | U$12.1 113.63,52.57 BNC-OUT3.2 | U$11.1 88.63,52.57 BNC-OUT2.2 | U$10.1 69.47,53.1 BNC-OUT1.2 | U$9.1 44.47,53.1 BNC-OUT0.2 | 37.38,27.61 44.96,27.61 U$13.1 38.63,27.57 BNC-OUT4.2 | U$14.1 63.63,27.57 BNC-OUT5.2 | U$15.1 88.63,27.57 BNC-OUT6.2 | U$16.1 113.63,27.57 BNC-OUT7.2 | 10.07,172.39 v3.98,173.39 8.4,172.39 J4.PAD2 | v10.07,167.31 J4.14 | U$1.1 44.77,162.8 44.77,163.1 | X1.2 1.68,16.85 v4.12,17.29 | v5,5 11,5 | v8.57,144.59 8.4,144.77 J4.PAD1
  other vias: 130,5 5,180 130,180 2.5,131.2 2.4,116.3 2.3,124.5 2.7,53.4 2.8,57.3 2.9,62.7 69.2,175
  pour Top (isolate 0.254): -5,186 140,186 138,-5 -7,-5
  pour Bottom: 0,65.7 5.5,65.7 5.5,51.6 0,51.6
  pour Bottom: -1,186 136,186 136,-3 -1,-3 -1,6 13,6 13,8 127,8 127,177 -1,177
AIN0  (via drill 0.35)
  Route15 0.254: HEADER-IN.3 13.56,111.11 12.62,110.16 12.62,90.12 SCREW-IN.1 SCREW-OUT1.1 | BNC-IN0.1 35,165.5 33.83,166.68 v24.68,166.68
  Bottom 0.254: SMA-IN0.CLK U$1.2 45,157.78 42.78,160 BNC-IN0.1 | J4.2 v24.68,166.68 29.12,162.23 29.12,155.25 31.66,152.7 31.66,142.3 34.45,139.51 34.45,137.45 32.75,135.75 32.75,134.25 34.4,132.6 34.4,130.94 31.66,128.2 31.66,116.5 25.28,110.12 14.72,110.12 HEADER-IN.3
AIN1  (via drill 0.35)
  Route15 0.254: v35.48,152.07 30.4,152.07 v30.39,152.06 | HEADER-IN.4 16.43,111.27 16.43,112.06 14.18,112.06 14.14,112.1 13.29,112.1 11.98,110.8 11.98,92.02 SCREW-IN.2 SCREW-OUT1.2
  Bottom 0.254: SMA-IN1.CLK U$2.2 67.43,160 BNC-IN1.1 60,156.91 48.81,145.72 41.83,145.72 v35.48,152.07 | J4.15 24.05,166.03 28.48,161.59 28.48,153.97 v30.39,152.06 31.02,151.44 31.03,151.44 31.03,140.5 29.7,139.17 29.7,125.93 31.03,124.6 31.03,117.1 25.04,111.11 HEADER-IN.4
AIN2  (via drill 0.35)
  Route15 0.254: v34.84,150.17 v29.76,150.17 | HEADER-IN.5 13.56,113.65 11.35,111.43 11.35,93.93 SCREW-IN.3 SCREW-OUT1.3
  Bottom 0.254: SMA-IN2.CLK U$3.2 92.43,160 BNC-IN2.1 85,156.51 73.58,145.08 41.19,145.08 36.11,150.17 v34.84,150.17 | J4.3 23.41,165.41 27.86,160.96 27.86,153.34 29.76,151.44 v29.76,150.17 29.76,149.53 30.2,149.09 30.2,141 29.12,139.93 29.12,125.44 29.76,124.8 29.76,116.8 25.62,112.66 14.72,112.66 HEADER-IN.5
AIN3  (via drill 0.35)
  Route15 0.254: v36.11,148.89 29.76,148.89 v29.12,148.26 | HEADER-IN.6 15.28,114.64 13.32,114.64 13.28,114.61 12.62,114.61 10.71,112.7 10.71,95.83 SCREW-IN.4 SCREW-OUT1.4
  Bottom 0.254: SMA-IN3.CLK U$4.2 117.43,160 BNC-IN3.1 110,153.34 98.86,142.2 78.75,142.2 76.5,144.45 40.55,144.45 v36.11,148.89 | J4.16 22.77,164.76 27.21,160.32 27.21,152.71 29.12,150.8 29.12,148.3 | HEADER-IN.6 25.63,113.65 28.49,116.51 28.49,140.31 29.48,141.3 29.48,147.94 29.12,148.3 | v29.12,148.26 29.12,148.3
AIN4  (via drill 0.35)
  Route15 0.254: v28.49,141.91 28.9,141.5 28.9,136.5 30.4,135 BNC-IN4.1 44.8,135 v45,134.8 | HEADER-IN.7 12.93,116.19 10.07,113.33 10.07,97.74 SCREW-IN.5 SCREW-OUT1.5 | SMA-IN4.CLK v45,129.1
  Bottom 0.254: J4.4 22.14,164.13 26.58,159.69 26.58,152.08 28.49,150.17 v28.49,141.91 28.41,141.91 27.86,141.36 27.86,117.14 25.59,114.88 14.88,114.88 13.73,116.03 HEADER-IN.7 | v45,134.8 U$5.2 v45,129.1
AIN5  (via drill 0.35)
  Route15 0.254: HEADER-IN.8 15.28,117.18 13.32,117.18 13.28,117.14 12.62,117.14 9.44,113.97 9.44,99.64 SCREW-IN.6 SCREW-OUT1.6 | v36.04,140.64 32,140.64 28.82,143.81 v27.22,143.81
  Bottom 0.254: BNC-IN5.1 60.24,135 | 60.24,135 67.43,135 U$6.2 SMA-IN5.CLK | J4.17 21.5,163.5 25.95,159.06 25.95,151.44 27.86,149.53 27.86,144.45 v27.22,143.81 27.22,119.05 24.36,116.19 HEADER-IN.8 | v36.04,140.64 58.96,140.64 60.24,139.36 60.24,135
AIN6  (via drill 0.35)
  Route15 0.254: v26.59,145.72 28,145.72 31.72,142 41,142 41.55,142.55 v43.09,142.55 | HEADER-IN.9 12.29,118.73 8.8,115.24 8.8,101.54 SCREW-IN.7 SCREW-OUT1.7
  Bottom 0.254: SMA-IN6.CLK U$7.2 92.43,135 BNC-IN6.1 84.92,134.93 81.83,134.93 73.89,142.86 43.41,142.86 v43.09,142.55 | J4.5 21.11,162.86 25.43,158.53 25.43,150.75 26.59,149.59 v26.59,145.72 26.59,120.32 23.77,117.5 14.96,117.5 HEADER-IN.9
AIN7  (via drill 0.35)
  Route15 0.254: v25.95,148.89 27.22,147.62 37.38,147.62 39.28,145.72 v39.28,143.81 | HEADER-IN.10 15.13,118.73 14.14,119.72 12.02,119.72 7.5,115.2 SCREW-IN.8 SCREW-OUT1.8
  Bottom 0.254: SMA-IN7.CLK U$8.2 117.43,135 BNC-IN7.1 103.98,135 97.59,141.39 77.91,141.39 75.48,143.81 v39.28,143.81 | J4.18 20.23,162.22 24.67,157.78 24.67,150.17 v25.95,148.89 25.95,120.95 23.73,118.73 HEADER-IN.10 | SCREW-IN.8 6.67,102.78
AIN8  (via drill 0.35)
  Route15 0.254: v34.2,117.78 34.2,118.42 32.94,119.69 v18.96,119.69
  Bottom 0.254: SMA-IN8.CLK U$17.2 42.43,110 BNC-IN8.1 35,116.98 v34.2,117.78 | J4.22 15.15,157.15 19.6,152.7 19.6,126.67 18.96,126.03 v18.96,119.69 18.93,119.72 15.28,119.72 HEADER-IN.11
AIN9  (via drill 0.35)
  Route15 0.254: HEADER-IN.12 19.29,121.27 v19.6,120.95 20.23,120.32 v34.2,120.32
  Bottom 0.254: SMA-IN9.CLK U$18.2 67.63,109.8 BNC-IN9.1 60.8,114.05 56.43,118.42 36.11,118.42 v34.2,120.32 | J4.9 15.79,157.78 20.23,153.34 20.23,126.03 19.6,125.4 v19.6,120.95
AIN10  (via drill 0.35)
  Route15 0.254: HEADER-IN.13 14.87,123.81 15.86,124.8 16.68,124.8 16.72,124.77 v20.23,124.77 32.94,124.77 v36.11,121.59
  Bottom 0.254: SMA-IN10.CLK U$19.2 92.43,110 BNC-IN10.1 85,115.25 81.19,119.05 38.65,119.05 v36.11,121.59 | J4.21 16.43,158.42 20.87,153.97 20.87,125.4 v20.23,124.77
AIN11  (via drill 0.35)
  Route15 0.254: HEADER-IN.14 16.59,123.5 v21.5,123.5 32.94,123.5 36.11,120.32 v38.65,120.32
  Bottom 0.254: SMA-IN11.CLK U$20.2 117.43,110 BNC-IN11.1 110,114.38 104.69,119.69 39.28,119.69 v38.65,120.32 | J4.8 17.06,159.05 21.5,154.61 21.5,124.14 21.5,124.13 v21.5,123.5
AIN12  (via drill 0.35)
  Route15 0.254: HEADER-IN.15 14.72,125.36 17.32,125.36 18,126.03 v24.05,126.03 34.84,126.03 41.19,119.69 v41.19,117.14
  Bottom 0.254: SMA-IN12.CLK U$21.2 42.43,85 BNC-IN12.1 35,89.37 39.92,94.28 48.17,94.28 50.08,96.19 50.08,112.7 47.54,115.24 43.09,115.24 v41.19,117.14 | J4.20 17.7,159.69 22.14,155.25 22.14,127.94 v24.05,126.03
AIN13  (via drill 0.35)
  Route15 0.254: HEADER-IN.16 17.23,127.31 v24.05,127.31 34.84,127.31 43.09,119.05 v43.09,117.14
  Bottom 0.254: SMA-IN13.CLK U$22.2 67.43,85 BNC-IN13.1 60,92.6 52.62,99.98 52.62,112.06 47.54,117.14 v43.09,117.14 | J4.7 18.33,160.32 22.77,155.88 22.77,128.57 v24.05,127.31
AIN14  (via drill 0.35)
  Route15 0.254: HEADER-IN.17 13.73,129.06 14.74,130.07 23.63,130.07 v24.05,130.48 26.4,130.48 27.48,129.4 40.32,129.4 41.4,130.48 46.91,130.48 v59.6,117.78
  Bottom 0.254: SMA-IN14.CLK U$23.2 92.43,85 BNC-IN14.1 78.9,85 76.11,87.78 76.11,112.06 70.4,117.78 v59.6,117.78 | J4.19 18.96,160.95 23.4,156.51 23.4,131.12 v24.05,130.48
AIN15  (via drill 0.35)
  Route15 0.254: HEADER-IN.18 16.59,129.21 v24.68,129.21 25.32,128.57 v34.2,128.57
  Bottom 0.254: U$24.2 117.43,85 BNC-IN15.1 109.14,85.87 | U$24.2 SMA-IN15.CLK | J4.6 19.6,161.59 24.05,157.15 24.05,132.57 25.32,131.3 25.32,129.84 v24.68,129.21 | v34.2,128.57 35.84,126.94 35.84,125.03 40.55,120.32 117.39,120.32 125.01,112.7 125.01,84.76 122.68,82.43 U$24.2
ANGD
  pour Bottom: 0,134 5.4,134 5.4,114.3 0,114.3
AOUT0
  Route15 0.254: SCREW-OUT2.1 SCREW-OUT.1
  Bottom 0.254: SMA-OUT0.CLK U$9.2 42.43,50 BNC-OUT0.1 23.49,50 22.14,48.65 | J4.1 25.32,167.94 26.05,167.2 28,167.2 29.7,165.5 29.7,156.2 32.4,153.5 32.4,142.9 35.7,139.6 35.7,137.2 37.1,135.8 37.1,134 35.19,132.09 35.19,130.41 32.41,127.64 32.41,117.09 34.2,115.3 34.2,112.4 22.14,100.34 22.14,48.65 | 22.14,48.65 19.6,46.11 HEADER-OUT.4 HEADER-OUT.3 13.11,46.11 12.19,45.19 12.19,43.01 12.62,42.58 12.62,22.63 10.89,20.91 | 10.89,20.91 9.98,20 SCREW-OUT.1 | X1.3 10.35,9.35 13.5,12.5 13.5,18.3 10.89,20.91
  pour Bottom (no thermals): 11.4,11.1 7.4,11.1 7.4,8.1 11.4,8.1
AOUT1  (via drill 0.35)
  Route15 0.254: v25.32,52.38 24.68,51.74 v20.87,51.74 | SCREW-OUT.2 SCREW-OUT2.2
  Bottom 0.254: SMA-OUT1.CLK U$10.2 67.43,50 BNC-OUT1.1 60,55 59.4,55.6 28.54,55.6 v25.32,52.38 | X1.1 6.55,16.85 5.4,18 5.4,21.74 6.2,22.54 SCREW-OUT.2 10.16,22.54 11.98,24.35 11.98,41.94 11.46,42.47 11.46,48.46 11.65,48.65 HEADER-OUT.5 HEADER-OUT.6 17.78,48.65 v20.87,51.74 21.5,52.38 21.5,77.78 12.2,87.08 12.2,141.2 14.4,143.4 14.4,150.9 13.2,152.1 12.24,152.1 J4.26
  pour Bottom (no thermals): 11.4,18.1 7.4,18.1 7.4,15.1 11.4,15.1
AOUT2  (via drill 0.35)
  Route15 0.254: v25.32,54.28 21.5,54.28 v19.92,52.69 | SCREW-OUT2.3 SCREW-OUT.3
  Bottom 0.254: SMA-OUT2.CLK U$11.2 92.43,50 BNC-OUT2.1 85,55.54 85,55.55 83.73,56.82 27.86,56.82 v25.32,54.28 | 11.19,51.19 11.35,51.19 | 11.35,51.19 HEADER-OUT.7 HEADER-OUT.8 16.36,51.1 18.33,51.1 v19.92,52.69 20.87,53.65 20.87,77.14 11.35,86.66 11.35,141.55 12.6,142.8 12.6,148.7 10.2,151.1 10.2,153.1 10.43,153.33 J4.25 | SCREW-OUT.3 8.8,25.08 11.35,27.62 11.35,41.31 10.71,41.94 10.71,50.56 11.35,51.19
AOUT3  (via drill 0.35)
  Route15 0.254: v24.05,54.91 v20.15,54.91 | SCREW-OUT.4 SCREW-OUT2.4
  Bottom 0.254: SMA-OUT3.CLK U$12.2 117.43,50 BNC-OUT3.1 110,55.32 107.23,58.09 27.22,58.09 v24.05,54.91 | J4.12 10.37,153.97 9.49,153.09 9.49,151.23 9.5,151.22 9.5,150.8 11.8,148.5 11.8,143.5 10.71,142.41 10.71,86.03 20.23,76.5 20.23,55 v20.15,54.91 18.96,53.73 HEADER-OUT.10 HEADER-OUT.9 10.73,53.73 10.04,53.04 10.04,41.31 10.07,41.31 10.71,40.68 10.71,29.44 8.89,27.62 SCREW-OUT.4
AOUT4  (via drill 0.35)
  Route15 0.254: v13.88,30.71 v9.44,30.71 v8.89,30.16 SCREW-OUT.5 SCREW-OUT2.5
  Bottom 0.254: SMA-OUT4.CLK U$13.2 42.43,25 BNC-OUT4.1 19.59,25 v13.88,30.71 | J4.24 9,154.6 3.73,149.33 3.73,141.28 10.07,134.93 10.07,85.4 19.6,75.87 19.6,58.18 17.7,56.27 HEADER-OUT.12 HEADER-OUT.11 13.01,55.55 10.71,55.55 9.44,54.28 9.44,40.68 10.07,40.04 10.07,31.34 v9.44,30.71 v8.89,30.16 SCREW-OUT.5
AOUT5  (via drill 0.35)
  Route15 0.254: v13.25,32.61 7.59,32.61 SCREW-OUT.6 SCREW-OUT2.6
  Bottom 0.254: SMA-OUT5.CLK U$14.2 67.43,25 BNC-OUT5.1 60,28.49 57.88,30.6 19.4,30.6 17.39,32.61 v13.25,32.61 | J4.11 4.5,155.25 3,153.75 3,140.73 9.44,134.29 9.44,84.76 18.96,75.24 18.92,75.19 18.92,60.04 17.7,58.81 HEADER-OUT.14 HEADER-OUT.13 12.06,58.81 8.8,55.55 8.8,40.04 9.44,39.41 9.44,33.88 8.26,32.7 SCREW-OUT.6
AOUT6  (via drill 0.35)
  Route15 0.254: SCREW-OUT2.7 SCREW-OUT.7 14.88,35.24 v15.7,34.42
  Bottom 0.254: SMA-OUT6.CLK U$15.2 92.43,25 BNC-OUT6.1 85,30 83.5,31.5 20.5,31.5 17.67,34.33 16.08,34.33 v15.7,34.42 | J4.23 4.1,155.87 2.3,154.07 2.3,140.16 8.8,133.66 8.8,79.99 9.79,79 9.79,71.91 12.5,69.2 17.38,69.2 18.33,68.25 18.33,61.9 17.7,61.26 16.36,61.26 HEADER-OUT.16 HEADER-OUT.15 12.62,61.35 8.17,56.91 8.17,39.41 8.8,38.77 8.8,35.78 8.26,35.24 SCREW-OUT.7
AOUT7  (via drill 0.35)
  Route15 0.254: SCREW-OUT2.8 SCREW-OUT.8 9.64,37.78 11,36.42 16.87,36.42 v17.6,35.69
  Bottom 0.254: SMA-OUT7.CLK U$16.2 117.43,25 BNC-OUT7.1 110,28.65 106.25,32.4 20.89,32.4 v17.6,35.69 | HEADER-OUT.18 14,63.89 | 14,63.89 HEADER-OUT.17 7.5,57.66 SCREW-OUT.8 | 14,63.89 13.58,63.47 5.5,71.56 5.5,82.34 6.26,83.1 6.26,104.44 8.17,106.35 8.17,133.02 1.6,139.59 1.6,154.62 3.5,156.51 4.36,156.51 4.37,156.51 J4.10
GND  (via drill 0.35)
  other vias: 1.3,212.7 4.3,213.6 1.2,207.2 3.7,207.2 1.4,202.2 3.7,202.2 3.7,197.2 1.2,197.2 1.6,191.3 4.4,191.1
  pour Route2 (no thermals): -5,187.4 140,187.4 140,239 -5,239
  pour Bottom (no thermals): -4.7,215.9 5.3,215.9 5.3,189.3 -4.7,189.3
N$1
  Bottom 0.7: J1.1 5.2,209.7
  Bottom 1.6: SMA-IN16.CLK 29.6,209.9 26.4,209.7 5.2,209.7
N$3
  Bottom 0.7: J2.1 5.2,204.7
  Bottom 1.6: SMA-IN18.CLK 57.1,209.9 51.6,204.4 5.5,204.4 5.2,204.7
N$4
  Bottom 0.7: J3.1 5.2,199.7
  Bottom 1.6: SMA-IN19.CLK 81.3,209.9 71.3,199.9 5.4,199.9 5.2,199.7
N$5
  Bottom 0.7: J5.1 5.2,194.7
  Bottom 1.6: SMA-IN17.CLK 106.3,209.9 91.14,194.74 8.29,194.74 5.2,194.7

### Text on the board
tPlace: M6 / 1/4"-20 | FMC / Breakout / Board | <- 1" -> | Rev. 1.1 / CERN OHL v1.2 / JV, JPN, MIT / 2019 | 1 | 50 Ohms | 50 Ohms | 50 Ohms | 50 Ohms | 2 | High / Speed | 3 | 4 | 1 | 2 | 3 | 4 | D. GND | M6 / 1/4"-20 | <- 1" -> | A. GND | bank 1 | bank 1 | bank 1 | bank 1 | ch. 1 | ch. 2 | ch. 3 | ch. 4 | 1 | 2 | 3 | 4 | bank 1 | bank 1 | bank 1 | bank 1 | GND | ch. 5 | ch. 6 | ch. 7 | ch. 8 | 15 | 16 | 5 | 6 | 7 | 8 | An. Input | 1 | 2 | bank 2 | bank 2 | bank 2 | bank 2 | 8 | GND | ch. 1 | ch. 2 | ch. 3 | ch. 4 | 9 | 10 | 11 | 12 | <- 1.125" -> / (19" Rack) | bank 2 | bank 2 | bank 2 | bank 2 | 1 | 21x M3, ~5mm | ch. 5 | ch. 6 | ch. 7 | ch. 8 | GND | 13 | 14 | 15 | 16 | GND | 15 | 16 | <- 1" -> | 1 | 2 | GND | 1 | 2 | 3 | 4 | 8 | An. Output | 1 | 5 | 6 | 7 | 8 | Chs. 1&2
bPlace: FMC / Breakout Board | Rev. 1.1 / CERN OHL v1.2 / JV, JPN, MIT / 2019 | Analog I/O